# EAGLE schematic lab3 (EAGLE 7.1.0)
Lab 3 Jonathan Valvano
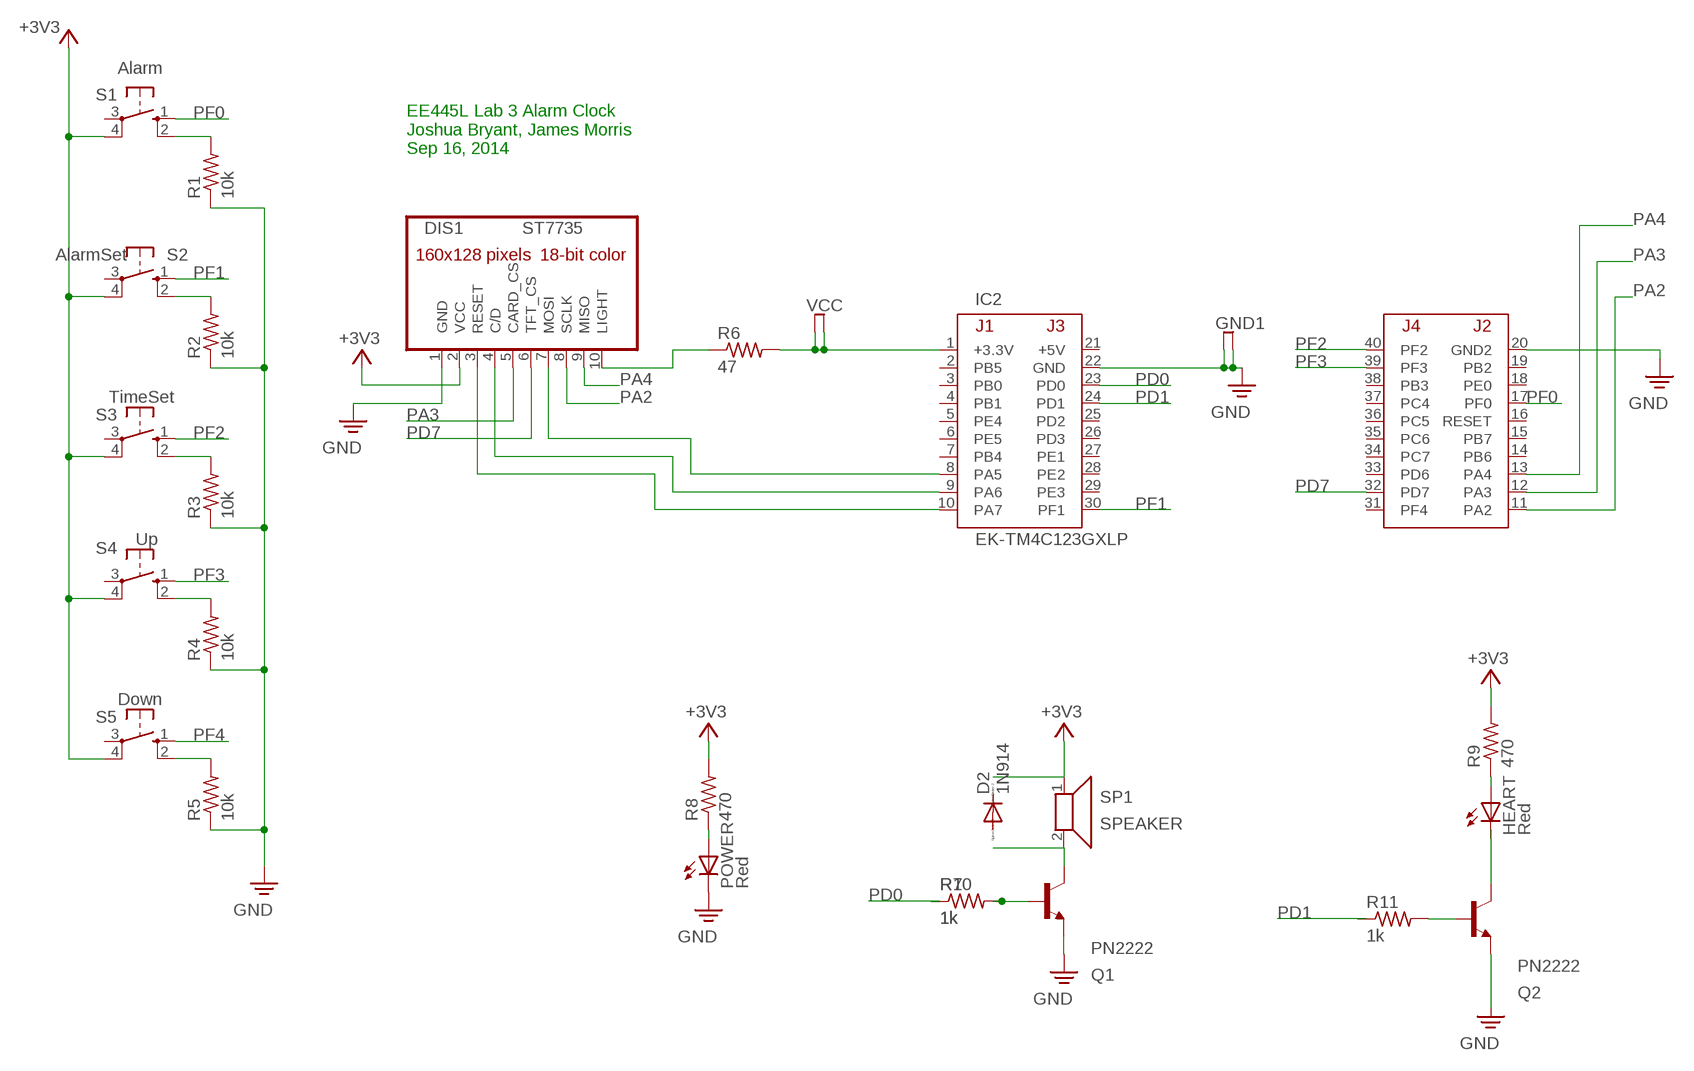
[diagram p0: schematic, sheet 1]

## Parts
D2  1N914  1N5060GP  [DO15-12]
DIS1  ST7735  [ST7735]
GND1  TP2  [TP2]
HEART  Red  LED5MM  [LED5MM]
IC2  EK-TM4C123GXLP  [TM4C123LAUNCHPAD]
POWER  Red  LED5MM  [LED5MM]
Q1  PN2222  [TO92]
Q2  PN2222  [TO92]
R1  10k  RESISTOR0204/5  [RES200MIL]
R2  10k  RESISTOR0204/5  [RES200MIL]
R3  10k  RESISTOR0204/5  [RES200MIL]
R4  10k  RESISTOR0204/5  [RES200MIL]
R5  10k  RESISTOR0204/5  [RES200MIL]
R6  47  RESISTORV526-0  [RES_VERTICAL]
R7  1k  RESISTOR0204/5  [RES200MIL]
R8  470  RESISTOR0204/5  [RES200MIL]
R9  470  RESISTOR0204/5  [RES200MIL]
R10  1k  RESISTOR0204/5  [RES200MIL]
R11  1k  RESISTOR0204/5  [RES200MIL]
S1  Alarm  B3F-1052  [B3F-10XX]
S2  AlarmSet  B3F-1052  [B3F-10XX]
S3  TimeSet  B3F-1052  [B3F-10XX]
S4  Up  B3F-1052  [B3F-10XX]
S5  Down  B3F-1052  [B3F-10XX]
SP1  SPEAKER  [1X02]
VCC  TP2  [TP2]

## Nets
+3V3: DIS1.2(VCC) R8.2 R9.2 S1.4(P1) S2.4(P1) S3.4(P1) S4.4(P1) S5.4(P1) SP1.1
GND: DIS1.1(GND) GND1.MP1(TPB) GND1.MP(TPA) IC2.20(GND2) IC2.22(GND) POWER.K(C) Q1.1(E) R1.1 R2.1 R3.1 R4.1 R5.1
LIGHT: DIS1.10(LIGHT) R6.1
N$1: IC2.1(+3.3V) R6.2 VCC.MP1(TPB) VCC.MP(TPA)
N$2: R1.2 S1.2(S1)
N$3: R2.2 S2.2(S1)
N$4: R3.2 S3.2(S1)
N$5: R4.2 S4.2(S1)
N$6: R5.2 S5.2(S1)
N$7: Q1.2(B) R7.2 R10.2
N$8: Q1.3(C) SP1.2
N$9: Q2.1(E)
N$10: Q2.3(C)
N$11: R7.1 R10.1
N$12: Q2.2(B) R11.2
PA2: DIS1.8(SCLK) IC2.11(PA2)
PA3: DIS1.5(CARD_CS) IC2.12(PA3)
PA4: DIS1.9(MISO) IC2.13(PA4)
PA5: DIS1.7(MOSI) IC2.8(PA5)
PA6: DIS1.4(C/D) IC2.9(PA6)
PA7: DIS1.3(RESET) IC2.10(PA7)
PD0: IC2.23(PD0)
PD1: IC2.24(PD1)
PD7: DIS1.6(TFT_CS) IC2.32(PD7)
PF0: IC2.17(PF0) S1.1(S)
PF1: S2.1(S)
PF2: IC2.40(PF2) S3.1(S)
PF3: S4.1(S)
PF4: S5.1(S)
VLED: POWER.A R8.1
VLED1: HEART.A R9.1
Unconnected: D2.A D2.C HEART.K(C) IC2.2(PB5) IC2.3(PB0) IC2.4(PB1) IC2.5(PE4) IC2.6(PE5) IC2.7(PB4) IC2.14(PB6) IC2.15(PB7) IC2.16(RESET) IC2.18(PE0) IC2.19(PB2) IC2.25(PD2) IC2.26(PD3) IC2.27(PE1) IC2.28(PE2) IC2.29(PE3) IC2.30(PF1) IC2.31(PF4) IC2.33(PD6) IC2.34(PC7) IC2.35(PC6) IC2.36(PC5) IC2.37(PC4) IC2.38(PB3) IC2.39(PF3) R11.1 S1.3(P) S2.3(P) S3.3(P) S4.3(P) S5.3(P)

## Notes on the sheet
- EE445L Lab 3 Alarm Clock
  Joshua Bryant, James Morris
  Sep 16, 2014

## Power pins joined to a net without a drawn wire
+5V: IC2.21(+5V)

## Library data of the parts
D2 = diode:1N5060GP: DIODE controlled avalanche rectifier
DIS1 = EE445L:ST7735: Sitronix ST7735R 18-bit color, 1.8" TFT LCD display, 128*160, http://www.adafruit.com/products/358 // Backlight (pin 10) connected to +3.3 V // MISO (pin 9) PA4 (SSI0Rx) // SCK (pin 8) connected to PA2 (SSI0Clk) // MOSI (pin 7) connected to PA5 (SSI0Tx) // TFT_CS (pin 6) connected to PA3 (SSI0Fss) // CARD_CS (pin 5) connected to PD7 GPIO output(for SDC) // Data/Command (pin 4) connected to PA6 (GPIO), high for data, low for command // RESET (pin 3) connected to PA7 (GPIO) // VCC (pin 2) connected to +3.3 V // Gnd (pin 1) connected to ground; OC_FARNELL: unknown; OC_NEWARK: unknown
GND1 VCC = EE445L:TP2: Low-cost test point Made with two 0.8mm holes.
HEART POWER = EE445L:LED: Avago Technologies LED Green 2mA 5mm diffused, HLMP-4740, Digikey 516-1327-ND Red 1.6V 1mA 5mm diffused, HLMP-D150, Digikey 516-1323-ND Yellow 2mA 5mm diffused, HLMP-4719, Digikey 516-1326-ND Orange 10mA 5mm diffused HLMP-D401, Digikey 516-1330-ND Blue 10mA 5mm diffused
IC2 = EE445L:EK-TM4C123GXL: Texas Instruments TM4C123 LaunchPad EK-TM4C123GXL www.ti.com/tool/ek-tm4c123gxl
Q1 Q2 = EE445L:PN2222: NPN Transistor
R1-R11 = EE445L:RESISTOR: RESISTOR, American symbol
S1-S5 = EE445L:B3F-1052: OMRON SWITCH 1.1mm holes; MPN: B3F-1000; OC_FARNELL: 176432; OC_NEWARK: 36M3542
SP1 = EE445L:SPEAKER: Speaker Connected off PCB with two wires. 32-ohm speaker, AllElectronics, SK-230, http://www.allelectronics.com/make-a-store/item/sk-230/20-mm-32-ohm-speaker/1.html

## Net classes
0 default: clearance 0.205 mm